# EAGLE design PDT3535LEDbackup (EAGLE 9.0.0)
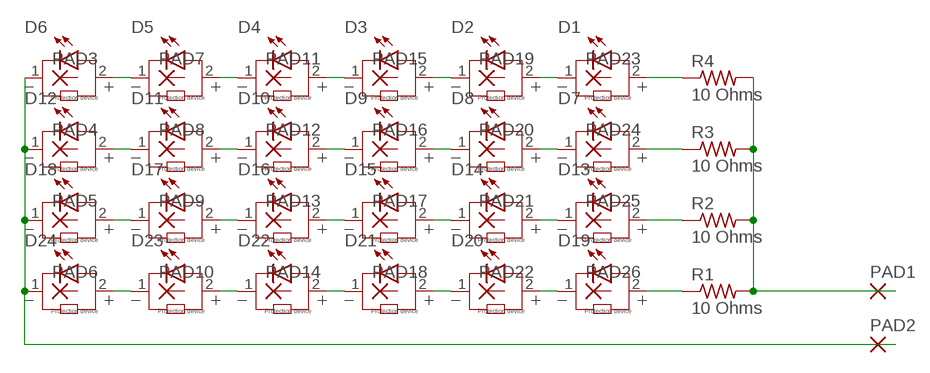
[diagram p0: schematic, sheet 1]

## Parts
D1  WL-SWTC_3535_158353060_6000K  [WL-SWTC_3535]
D2  WL-SWTC_3535_158353060_6000K  [WL-SWTC_3535]
D3  WL-SWTC_3535_158353060_6000K  [WL-SWTC_3535]
D4  WL-SWTC_3535_158353060_6000K  [WL-SWTC_3535]
D5  WL-SWTC_3535_158353060_6000K  [WL-SWTC_3535]
D6  WL-SWTC_3535_158353060_6000K  [WL-SWTC_3535]
D7  WL-SWTC_3535_158353060_6000K  [WL-SWTC_3535]
D8  WL-SWTC_3535_158353060_6000K  [WL-SWTC_3535]
D9  WL-SWTC_3535_158353060_6000K  [WL-SWTC_3535]
D10  WL-SWTC_3535_158353060_6000K  [WL-SWTC_3535]
D11  WL-SWTC_3535_158353060_6000K  [WL-SWTC_3535]
D12  WL-SWTC_3535_158353060_6000K  [WL-SWTC_3535]
D13  WL-SWTC_3535_158353060_6000K  [WL-SWTC_3535]
D14  WL-SWTC_3535_158353060_6000K  [WL-SWTC_3535]
D15  WL-SWTC_3535_158353060_6000K  [WL-SWTC_3535]
D16  WL-SWTC_3535_158353060_6000K  [WL-SWTC_3535]
D17  WL-SWTC_3535_158353060_6000K  [WL-SWTC_3535]
D18  WL-SWTC_3535_158353060_6000K  [WL-SWTC_3535]
D19  WL-SWTC_3535_158353060_6000K  [WL-SWTC_3535]
D20  WL-SWTC_3535_158353060_6000K  [WL-SWTC_3535]
D21  WL-SWTC_3535_158353060_6000K  [WL-SWTC_3535]
D22  WL-SWTC_3535_158353060_6000K  [WL-SWTC_3535]
D23  WL-SWTC_3535_158353060_6000K  [WL-SWTC_3535]
D24  WL-SWTC_3535_158353060_6000K  [WL-SWTC_3535]
PAD1  1,6/0,8  [1,6/0,8]
PAD2  1,6/0,8  [1,6/0,8]
PAD3  2,54/1,1  [2,54/1,1]
PAD4  2,54/1,1  [2,54/1,1]
PAD5  2,54/1,1  [2,54/1,1]
PAD6  2,54/1,1  [2,54/1,1]
PAD7  2,54/1,1  [2,54/1,1]
PAD8  2,54/1,1  [2,54/1,1]
PAD9  2,54/1,1  [2,54/1,1]
PAD10  2,54/1,1  [2,54/1,1]
PAD11  2,54/1,1  [2,54/1,1]
PAD12  2,54/1,1  [2,54/1,1]
PAD13  2,54/1,1  [2,54/1,1]
PAD14  2,54/1,1  [2,54/1,1]
PAD15  2,54/1,1  [2,54/1,1]
PAD16  2,54/1,1  [2,54/1,1]
PAD17  2,54/1,1  [2,54/1,1]
PAD18  2,54/1,1  [2,54/1,1]
PAD19  2,54/1,1  [2,54/1,1]
PAD20  2,54/1,1  [2,54/1,1]
PAD21  2,54/1,1  [2,54/1,1]
PAD22  2,54/1,1  [2,54/1,1]
PAD23  2,54/1,1  [2,54/1,1]
PAD24  2,54/1,1  [2,54/1,1]
PAD25  2,54/1,1  [2,54/1,1]
PAD26  2,54/1,1  [2,54/1,1]
R1  10 Ohms  R-US_0617/22  [0617/22]
R2  10 Ohms  R-US_0617/22  [0617/22]
R3  10 Ohms  R-US_0617/22  [0617/22]
R4  10 Ohms  R-US_0617/22  [0617/22]

## Nets
N$1: D19.2 R1.1
N$2: D19.1 D20.2
N$3: D20.1 D21.2
N$4: D21.1 D22.2
N$5: D22.1 D23.2
N$6: D23.1 D24.2
N$7: D13.2 R2.1
N$8: D13.1 D14.2
N$9: D14.1 D15.2
N$10: D15.1 D16.2
N$11: D16.1 D17.2
N$12: D17.1 D18.2
N$13: D7.2 R3.1
N$14: D7.1 D8.2
N$15: D8.1 D9.2
N$16: D9.1 D10.2
N$17: D10.1 D11.2
N$18: D11.1 D12.2
N$19: D1.2 R4.1
N$20: D1.1 D2.2
N$21: D2.1 D3.2
N$22: D3.1 D4.2
N$23: D4.1 D5.2
N$24: D5.1 D6.2
N$25: D6.1 D12.1 D18.1 D24.1 PAD2.1(P)
N$26: PAD1.1(P) R1.2 R2.2 R3.2 R4.2
Unconnected: PAD3.1(P) PAD4.1(P) PAD5.1(P) PAD6.1(P) PAD7.1(P) PAD8.1(P) PAD9.1(P) PAD10.1(P) PAD11.1(P) PAD12.1(P) PAD13.1(P) PAD14.1(P) PAD15.1(P) PAD16.1(P) PAD17.1(P) PAD18.1(P) PAD19.1(P) PAD20.1(P) PAD21.1(P) PAD22.1(P) PAD23.1(P) PAD24.1(P) PAD25.1(P) PAD26.1(P)

## Library data of the parts
D1-D24 = Wurth_Elektronik_Optoelectronics_rev17b:WL-SWTC_3535: WL-SWTC SMD White Top view Ceramic LED Size 3535, waterclear dome lens Characteristics Fast switching No IR radiation High brightness Minimal side emission Waterclear silicone lens Top view Flexible coupling with secondary optic Various color temperatures Compact footprint Thermal resistance junction to solder point: 8 °K/W LED junction temperature: 150 °C Moisture Sensitivity Level: 2 Applications Indoor lighting: Spot light, Down light Outdoor lighting: Street light, Security light, Tunnel light, Parking lots light Industrial lighting: High-bay light, Low-bay light Consumer lighting: Torch light Agricultural equipment lighting Signal and symbol luminaries <http://katalog.we-online.de/media/images/eipal/WL-SWTC_pf2.jpg> Details see: http://katalog.we-online.de/en/led/WL-SWTC/158353060?m Created 2015-01-06, 2015 (C) Wurth Elektronik
PAD1 PAD2 = wirepad:1,6/0,8: THROUGH-HOLE PAD
PAD3-PAD26 = wirepad:2,54/1,1: THROUGH-HOLE PAD
R1-R4 = resistor:R-US_: RESISTOR, American symbol

## Board
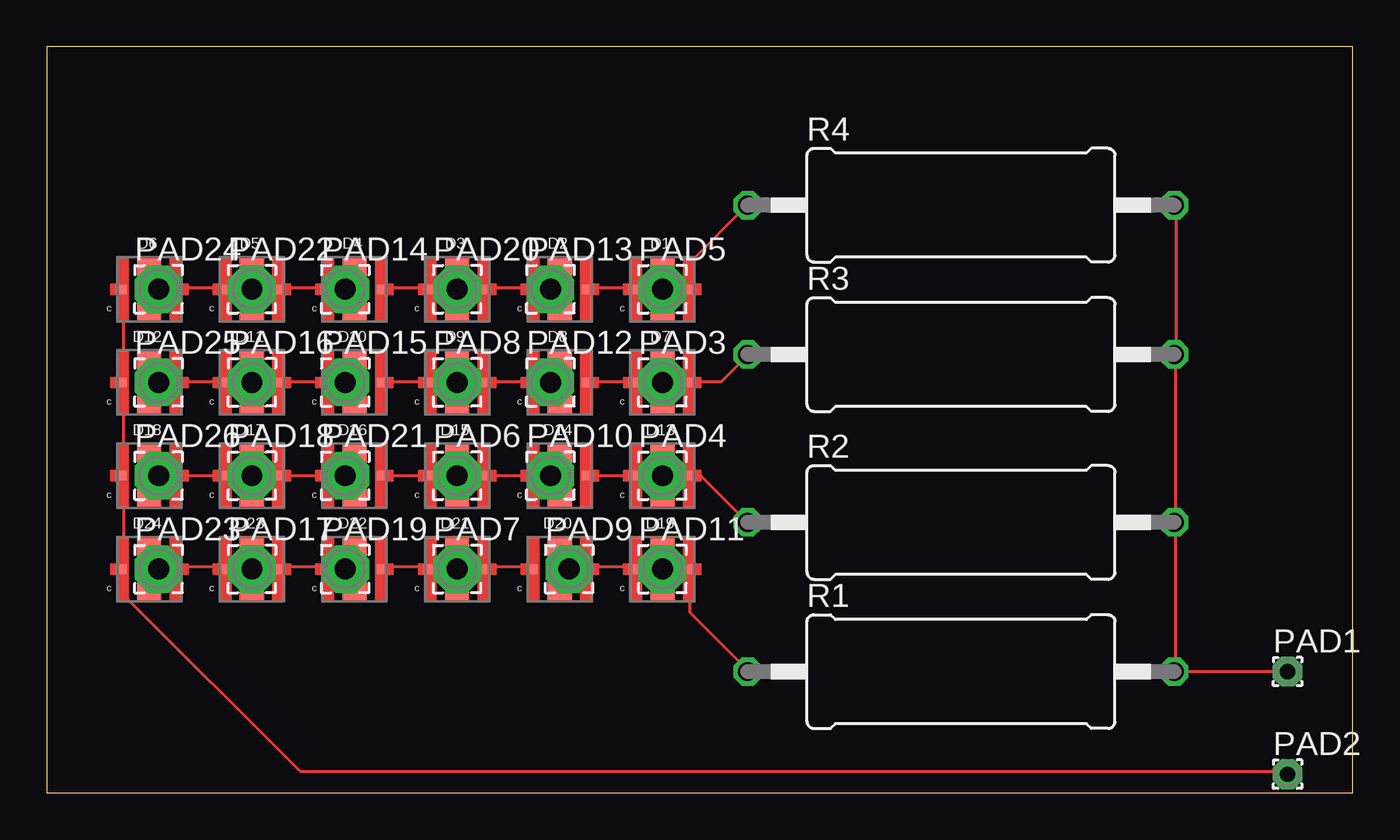
[diagram p1: board, top side]

Size 70 x 40 mm. Coordinates in mm from the lower left corner, seen from the top.
Outline: 0,0 70,0 70,40 0,40 0,0
Copper layers (1*16): Top 0.035mm / dielectric 1.5mm / Bottom 0.035mm
Design rules "default": minimum track width 6mil, minimum drill 0.35mm, track to track 6mil, track to pad 6mil, pad to pad 6mil, via to via 6mil, smd to smd 6mil, copper to edge 40mil, drill to drill 6mil, minimum pad ring 10mil, minimum via ring 8mil, stop-mask expansion 4mil, vias tented up to drill 0mil, thermal gap 10mil

### Footprints (pad centres in the part's own frame; a part is rotated, then mirrored left to right if it is on the bottom)
WL-SWTC_3535 = smd 0.4 x 0.5: 1 -1.4,0; 2 1.4,0 | smd 1.3 x 3.3: 3 0,0
1,6/0,8 = drill 0.813 pad 1.6 octagon: 1 0,0
2,54/1,1 = drill 1.118 pad 2.54 octagon: 1 0,0
0617/22 = drill 1.016 octagon: 1 -11.43,0; 2 11.43,0

### Placement (x,y rotation side)
D1  33,27 0 top
D2  27.5,27 0 top
D3  22,27 0 top
D4  16.5,27 0 top
D5  11,27 0 top
D6  5.5,27 0 top
D7  33,22 0 top
D8  27.5,22 0 top
D9  22,22 0 top
D10  16.5,22 0 top
D11  11,22 0 top
D12  5.5,22 0 top
D13  33,17 0 top
D14  27.5,17 0 top
D15  22,17 0 top
D16  16.5,17 0 top
D17  11,17 0 top
D18  5.5,17 0 top
D19  33,12 0 top
D20  27.5,12 0 top
D21  22,12 0 top
D22  16.5,12 0 top
D23  11,12 0 top
D24  5.5,12 0 top
PAD1  66.5,6.5 0 top
PAD2  66.5,1 0 top
PAD3  33,22 0 top
PAD4  33,17 0 top
PAD5  33,27 0 top
PAD6  22,17 0 top
PAD7  22,12 0 top
PAD8  22,22 0 top
PAD9  28,12 0 top
PAD10  27,17 0 top
PAD11  33,12 0 top
PAD12  27,22 0 top
PAD13  27,27 0 top
PAD14  16,27 0 top
PAD15  16,22 0 top
PAD16  11,22 0 top
PAD17  11,12 0 top
PAD18  11,17 0 top
PAD19  16,12 0 top
PAD20  22,27 0 top
PAD21  16,17 0 top
PAD22  11,27 0 top
PAD23  6,12 0 top
PAD24  6,27 0 top
PAD25  6,22 0 top
PAD26  6,17 0 top
R1  49,6.5 0 top
R2  49,14.5 0 top
R3  49,23.5 0 top
R4  49,31.5 0 top

### Tracks (layer width: path | path; a pad name or v marks a point on that pad's centre or on a via)
N$1
  Top 0.152: D19.2 34.47,11.97 34.47,9.68 37.51,6.63 R1.1
N$2
  Top 0.152: D20.2 28.98,12.12 31.57,12.12 D19.1
N$3
  Top 0.152: D21.2 23.49,12.12 26.08,12.12 D20.1
N$4
  Top 0.152: D22.2 18.01,12.12 20.6,12.12 D21.1
N$5
  Top 0.152: D23.2 12.52,12.12 14.96,12.12 D22.1
N$6
  Top 0.152: D24.2 7.03,12.12 9.47,12.12 D23.1
N$7
  Top 0.152: D13.2 34.47,17 35.08,17 37.51,14.56 R2.1
N$8
  Top 0.152: D14.2 28.98,17 31.57,17 D13.1
N$9
  Top 0.152: D15.2 23.49,17 26.08,17 D14.1
N$10
  Top 0.152: D16.2 18.01,17 D15.1
N$11
  Top 0.152: D17.2 12.52,17 14.96,17 D16.1
N$12
  Top 0.152: D18.2 7.03,17 9.47,17 D17.1
N$13
  Top 0.152: D7.2 34.47,22.03 36.14,22.03 37.51,23.4 R3.1
N$14
  Top 0.152: D8.2 28.98,22.03 31.57,22.03 D7.1
N$15
  Top 0.152: D9.2 23.49,22.03 26.08,22.03 D8.1
N$16
  Top 0.152: D10.2 18.01,22.03 20.6,22.03 D9.1
N$17
  Top 0.152: D11.2 12.52,22.03 14.96,22.03 D10.1
N$18
  Top 0.152: D12.2 7.03,22.03 9.47,22.03 D11.1
N$19
  Top 0.152: D1.2 34.47,27.06 34.47,28.43 37.51,31.48 R4.1
N$20
  Top 0.152: D2.2 28.98,27.06 31.57,27.06 D1.1
N$21
  Top 0.152: D3.2 23.49,27.06 26.08,27.06 D2.1
N$22
  Top 0.152: D4.2 18.01,27.06 20.6,27.06 D3.1
N$23
  Top 0.152: D5.2 12.52,27.06 14.96,27.06 D4.1
N$24
  Top 0.152: D6.2 7.03,27.06 9.47,27.06 D5.1
N$25
  Top 0.152: D6.1 4.14,26.9 4.14,22.03 D12.1 4.14,21.87 4.14,17.15 D18.1 4.14,17 4.14,12.12 D24.1 4.14,11.97 4.14,10.6 13.59,1.15 66.47,1.15 PAD2.1
N$26
  Top 0.152: R4.2 60.53,31.48 60.53,23.55 R3.2 60.53,23.4 60.53,14.56 R2.2 60.53,14.41 60.53,6.63 | 60.53,6.63 R1.2 | PAD1.1 60.66,6.5 60.53,6.63